# Altium project 驱动.PrjPcb
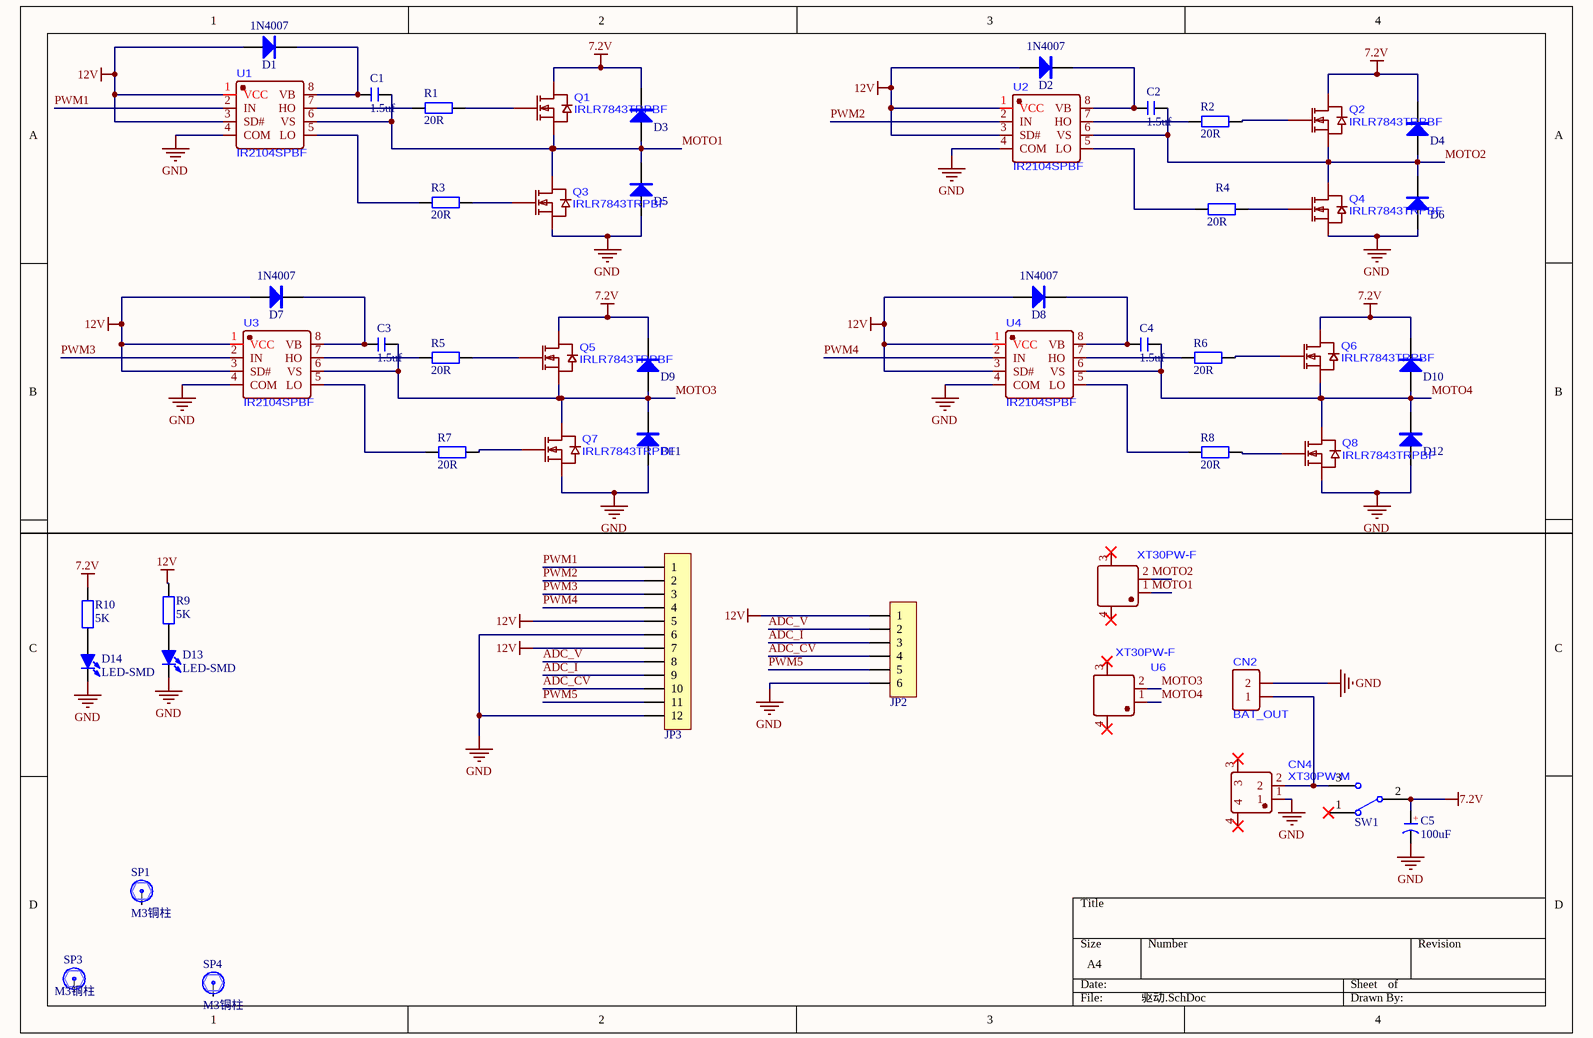
[diagram p0: 驱动.SchDoc]
1 sheet, 51 parts. Net scope: global (net labels, ports and power ports of the same name join across sheets).
Board file: 驱动.PcbDoc

## Sheet 驱动.SchDoc
size A4; DocumentNumber: 1; SheetNumber: 1; SheetTotal: 1

### Parts
C1  1.5uf  [C 0603_M]
C2  1.5uf  [C 0603_M]
C3  1.5uf  [C 0603_M]
C4  1.5uf  [C 0603_M]
C5  value 100uF  [CAP 2.0*5*11-H - BK]  (hidden comment: C-CAP)
CN2  BAT_OUT  [CONN-TH_XT30UPB-F]
CN4  XT30PW-M  [CONN-TH_XT30PW-M]
D1  1N4007  [SMA]
D2  1N4007  [SMA]
D3  SS14  [SMA]  (value not drawn)
D4  SS14  [SMA]  (value not drawn)
D5  SS14  [SMA]  (value not drawn)
D6  SS14  [SMA]  (value not drawn)
D7  1N4007  [SMA]
D8  1N4007  [SMA]
D9  SS14  [SMA]  (value not drawn)
D10  SS14  [SMA]  (value not drawn)
D11  SS14  [SMA]  (value not drawn)
D12  SS14  [SMA]  (value not drawn)
D13  LED-SMD  [LED 0603G]
D14  LED-SMD  [LED 0603G]
JP2  HDR-1X6  [XH2.54-WI-6P]  (value not drawn)
JP3  HDR-1X12  [XH2.54-WI-12P]  (value not drawn)
Q1  IRLR7843TRPBF  [TO-252-2_L6.5-W6.1-P4.58-LS10.0-TR]
Q2  IRLR7843TRPBF  [TO-252-2_L6.5-W6.1-P4.58-LS10.0-TR]
Q3  IRLR7843TRPBF  [TO-252-2_L6.5-W6.1-P4.58-LS10.0-TR]
Q4  IRLR7843TRPBF  [TO-252-2_L6.5-W6.1-P4.58-LS10.0-TR]
Q5  IRLR7843TRPBF  [TO-252-2_L6.5-W6.1-P4.58-LS10.0-TR]
Q6  IRLR7843TRPBF  [TO-252-2_L6.5-W6.1-P4.58-LS10.0-TR]
Q7  IRLR7843TRPBF  [TO-252-2_L6.5-W6.1-P4.58-LS10.0-TR]
Q8  IRLR7843TRPBF  [TO-252-2_L6.5-W6.1-P4.58-LS10.0-TR]
R1  20R  [C 0603_M]
R2  20R  [C 0603_M]
R3  20R  [C 0603_M]
R4  20R  [C 0603_M]
R5  20R  [C 0603_M]
R6  20R  [C 0603_M]
R7  20R  [C 0603_M]
R8  20R  [C 0603_M]
R9  value 5K  [R 0603_M]  (hidden comment: R)
R10  value 5K  [R 0603_M]  (hidden comment: R)
SP1  M3铜柱  [M3x4+6_L]
SP3  M3铜柱  [M3x4+6_L]
SP4  M3铜柱  [M3x4+6_L]
SW1  MTS-10x  [MTS-10x]  (value not drawn)
U1  IR2104SPBF  [SOIC-8_L5.0-W4.0-P1.27-LS6.0-BL]
U2  IR2104SPBF  [SOIC-8_L5.0-W4.0-P1.27-LS6.0-BL]
U3  IR2104SPBF  [SOIC-8_L5.0-W4.0-P1.27-LS6.0-BL]
U4  IR2104SPBF  [SOIC-8_L5.0-W4.0-P1.27-LS6.0-BL]
U5  XT30PW-F  [CONN-TH_XT30PW-F]
U6  XT30PW-F  [CONN-TH_XT30PW-F]

### Nets
7.2V: C5.1(A) D3.2(K) D4.2(K) D9.2(K) D10.2(K) Q1.4(D) Q2.4(D) Q5.4(D) Q6.4(D) R10.1 SW1.2
12V: D1.1(A) D2.1(A) D7.1(A) D8.1(A) JP2.1 JP3.5 JP3.7 R9.1 U1.1(VCC) U1.3(SD#) U2.1(VCC) U2.3(SD#) U3.1(VCC) U3.3(SD#) U4.1(VCC) U4.3(SD#)
GND: C5.2(K) CN2.2 CN4.1 D5.1(A) D6.1(A) D11.1(A) D12.1(A) D13.2(K) D14.2(K) JP2.6 JP3.6 JP3.12 Q3.3(S) Q4.3(S) Q7.3(S) Q8.3(S) U1.4(COM) U2.4(COM) U3.4(COM) U4.4(COM)
ADC_CV: JP2.4 JP3.10
ADC_I: JP2.3 JP3.9
ADC_V: JP2.2 JP3.8
MOTO1: C1.2 D3.1(A) D5.2(K) Q1.3(S) Q3.4(D) U1.6(VS) U5.1
MOTO2: C2.2 D4.1(A) D6.2(K) Q2.3(S) Q4.4(D) U2.6(VS) U5.2
MOTO3: C3.2 D9.1(A) D11.2(K) Q5.3(S) Q7.4(D) U3.6(VS) U6.2
MOTO4: C4.2 D10.1(A) D12.2(K) Q6.3(S) Q8.4(D) U4.6(VS) U6.1
PWM1: JP3.1 U1.2(IN)
PWM2: JP3.2 U2.2(IN)
PWM3: JP3.3 U3.2(IN)
PWM4: JP3.4 U4.2(IN)
PWM5: JP2.5 JP3.11
NetC1_1: C1.1 D1.2(K) U1.8(VB)
NetC2_1: C2.1 D2.2(K) U2.8(VB)
NetC3_1: C3.1 D7.2(K) U3.8(VB)
NetC4_1: C4.1 D8.2(K) U4.8(VB)
NetCN2_1: CN2.1 CN4.2 SW1.3
NetD13_1: D13.1(A) R9.2
NetD14_1: D14.1(A) R10.2
NetQ1_1: Q1.1(G) R1.2
NetQ2_1: Q2.1(G) R2.2
NetQ3_1: Q3.1(G) R3.2
NetQ4_1: Q4.1(G) R4.2
NetQ5_1: Q5.1(G) R5.2
NetQ6_1: Q6.1(G) R6.2
NetQ7_1: Q7.1(G) R7.2
NetQ8_1: Q8.1(G) R8.2
NetR1_1: R1.1 U1.7(HO)
NetR2_1: R2.1 U2.7(HO)
NetR3_1: R3.1 U1.5(LO)
NetR4_1: R4.1 U2.5(LO)
NetR5_1: R5.1 U3.7(HO)
NetR6_1: R6.1 U4.7(HO)
NetR7_1: R7.1 U3.5(LO)
NetR8_1: R8.1 U4.5(LO)

Not connected (* = marked no-connect by the designer): CN4 3* 4*; SP1 1; SP3 1; SP4 1; SW1 1*; U5 3* 4*; U6 3* 4*

### Notes on the sheet
- (in symbol C-CAP) +

### Library data of the parts
C1-C4 = C: 无极性贴片电容; 版权归属: 源创客; BOM名称: 无极性贴片电容; 学习资源: www.ooocke.com
C5 = C-CAP: 直插电解电容; 版权归属: 电协硬件组
CN2 = XT30UPB-F
D1-D12 = SS14: 肖特基二极管; 版权归属: 电协硬件组
D13 D14 = LED-SMD: 贴片LED; 版权归属: 电协硬件组
JP2 = Header 6: 6P接插件; 版权归属: 源创客; BOM名称: 6P接插件; 学习资源: www.ooocke.com
JP3 = Header 12: 12P接插件; 版权归属: 源创客; BOM名称: 12P接插件; 学习资源: www.ooocke.com
R1-R8 = R: 贴片电阻; 版权归属: 源创客; BOM名称: 贴片电阻; 学习资源: www.ooocke.com
R9 R10 = R: 贴片电阻; 版权归属: 电协硬件组
SP1 SP3 SP4 = 铜柱加头小焊盘: 铜柱; 版权归属: 电协硬件组
SW1 = MTS-10x: MTS10x系列3脚扭子开关; 版权归属: 电协硬件组